# EAGLE design Inverter-demo (1) (EAGLE 9.6.2)
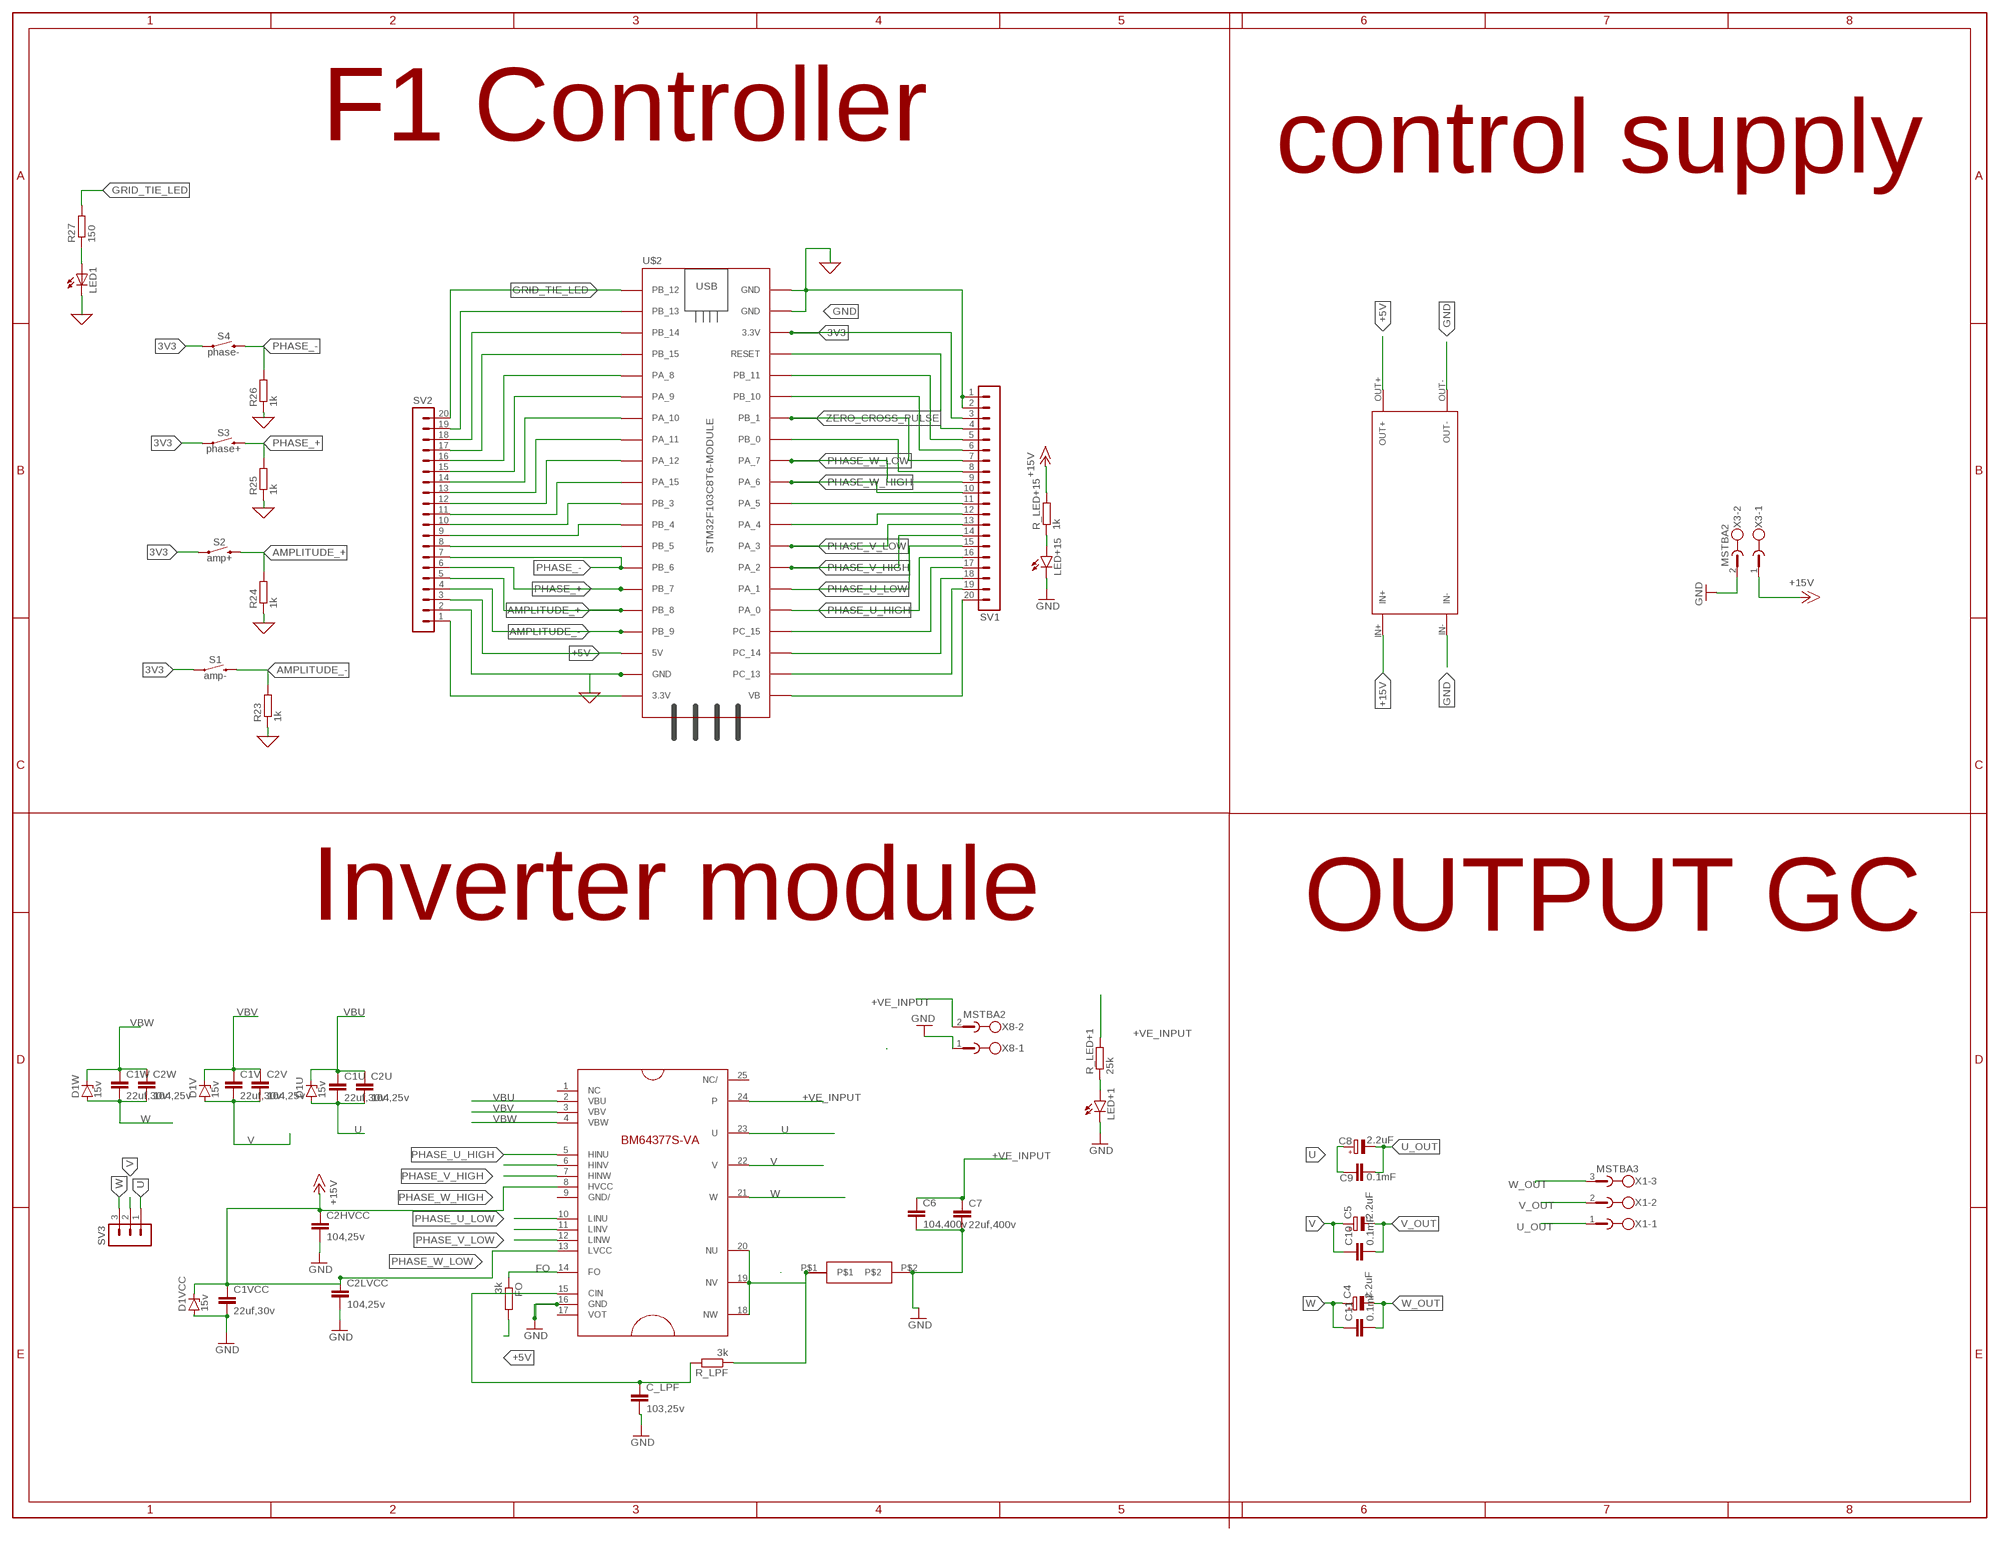
[diagram p0: schematic, sheet 1]

## Parts
C1U  22uf,30v  C-EU050-025X075  [C050-025X075]
C1V  22uf,30v  C-EU050-025X075  [C050-025X075]
C1VCC  22uf,30v  C-EU050-025X075  [C050-025X075]
C1W  22uf,30v  C-EU050-025X075  [C050-025X075]
C2HVCC  104,25v  C-EU050-025X075  [C050-025X075]
C2LVCC  104,25v  C-EU050-025X075  [C050-025X075]
C2U  104,25v  C-EU050-025X075  [C050-025X075]
C2V  104,25v  C-EU050-025X075  [C050-025X075]
C2W  104,25v  C-EU050-025X075  [C050-025X075]
C4  2.2uF  CPOL-EUE3.5-8  [E3,5-8]
C5  2.2uF  CPOL-EUE3.5-8  [E3,5-8]
C6  104,400v  C-EU050-025X075  [C050-025X075]
C7  22uf,400v  C-EU050-025X075  [C050-025X075]
C8  2.2uF  CPOL-EUE3.5-8  [E3,5-8]
C9  0.1mF  C5/5  [C5B5]
C10  0.1mF  C5/5  [C5B5]
C11  0.1mF  C5/5  [C5B5]
C_LPF  103,25v  C-EU050-025X075  [C050-025X075]
D1U  15v  ZENER-DIODEDO34-7  [DO34Z7]
D1V  15v  ZENER-DIODEDO34-7  [DO34Z7]
D1VCC  15v  ZENER-DIODEDO34-7  [DO34Z7]
D1W  15v  ZENER-DIODEDO34-7  [DO34Z7]
FO  3k  R-EU_0207/10  [0207/10]
LED1  LED3MM  [LED3MM]
LED+1  LED5MM  [LED5MM]
LED+15  LED5MM  [LED5MM]
R23  1k  R-EU_0207/10  [0207/10]
R24  1k  R-EU_0207/10  [0207/10]
R25  1k  R-EU_0207/10  [0207/10]
R26  1k  R-EU_0207/10  [0207/10]
R27  150  R-EU_0207/10  [0207/10]
R_LED+1  25k  R-EU_0207/10  [0207/10]
R_LED+15  1k  R-EU_0207/10  [0207/10]
R_LPF  3k  R-EU_0207/10  [0207/10]
S1  amp-  MOMENTARY-SWITCH-SPST-PTH-6.0MM  [TACTILE_SWITCH_PTH_6.0MM]
S2  amp+  MOMENTARY-SWITCH-SPST-PTH-6.0MM  [TACTILE_SWITCH_PTH_6.0MM]
S3  phase+  MOMENTARY-SWITCH-SPST-PTH-6.0MM  [TACTILE_SWITCH_PTH_6.0MM]
S4  phase-  MOMENTARY-SWITCH-SPST-PTH-6.0MM  [TACTILE_SWITCH_PTH_6.0MM]
SV1  MA20-1  [MA20-1]
SV2  MA20-1  [MA20-1]
SV3  MA03-1  [MA03-1]
U$1  BM64377S-VATHROUGH_HOLE  [IPM-BM64377S-VA]
U$2  STM32F103C8T6-MODULE  [STM32F103C8T6-MODULE]
U$3  SMALLSHUNT  [SMALLSHUNT]
U$4  XL4015_DC-DC_CONVERTER  [XL4015_DC-DC_CONVERTER]
X1  MSTBA3  [MSTBA3]
X3  MSTBA2  [MSTBA2]
X8  MSTBA2  [MSTBA2]

## Nets
3V3: S1.1 S2.1 S3.1 S4.1 SV1.3 U$2.3.3V_2(3.3V)
+5V: FO.2 SV2.3 U$2.5V U$4.OUT+
+15V: C1VCC.1 C2HVCC.1 C2LVCC.1 D1VCC.C R_LED+15.2 U$1.8(HVCC) U$1.13(LVCC) U$4.IN+ X3.1
+VE_INPUT: C6.1 C7.1 R_LED+1.2 U$1.24(P) X8.2
AMPLITUDE_+: R24.2 S2.3 SV2.5 U$2.PB_8
AMPLITUDE_-: R23.2 S1.3 SV2.4 U$2.PB_9
FO: FO.1 U$1.14(FO)
GND: C1VCC.2 C2HVCC.2 C2LVCC.2 C6.2 C7.2 C_LPF.2 D1VCC.A LED1.K(C) LED+1.K(C) LED+15.K(C) R23.1 R24.1 R25.1 R26.1 SV1.1 SV1.2 SV2.2 U$1.16(GND) U$2.GND_1(GND) U$2.GND_2(GND) U$2.GND_3(GND) U$3.P$2 U$4.IN- U$4.OUT- X3.2 X8.1
GRID_TIE_LED: R27.2 SV2.20 U$2.PB_12
N$1: LED+1.A R_LED+1.1
N$2: C_LPF.1 R_LPF.2 U$1.15(CIN)
N$5: R_LPF.1 U$1.18(NW) U$1.19(NV) U$1.20(NU) U$3.P$1
N$6: SV2.19 U$2.PB_13
N$7: SV2.18 U$2.PB_14
N$8: SV2.17 U$2.PB_15
N$9: SV2.16 U$2.PA_8
N$10: SV2.15 U$2.PA_9
N$11: SV2.14 U$2.PA_10
N$12: SV2.13 U$2.PA_11
N$13: SV2.12 U$2.PA_12
N$14: SV2.11 U$2.PA_15
N$15: SV2.10 U$2.PB_3
N$16: SV2.9 U$2.PB_4
N$17: LED1.A R27.1
N$18: SV2.8 U$2.PB_5
N$21: LED+15.A R_LED+15.1
N$22: SV2.1 U$2.3.3V_1(3.3V)
N$23: SV1.20 U$2.VB
N$24: SV1.19 U$2.PC_13
N$25: SV1.18 U$2.PC_14
N$26: SV1.17 U$2.PC_15
N$27: SV1.12 U$2.PA_4
N$28: SV1.11 U$2.PA_5
N$31: SV1.8 U$2.PB_0
N$33: SV1.6 U$2.PB_10
N$34: SV1.5 U$2.PB_11
N$35: SV1.4 U$2.RESET
PHASE_+: R25.2 S3.3 SV2.6 U$2.PB_7
PHASE_-: R26.2 S4.3 SV2.7 U$2.PB_6
PHASE_U_HIGH: SV1.16 U$1.5(HINU) U$2.PA_0
PHASE_U_LOW: SV1.15 U$1.10(LINU) U$2.PA_1
PHASE_V_HIGH: SV1.14 U$1.6(HINV) U$2.PA_2
PHASE_V_LOW: SV1.13 U$1.11(LINV) U$2.PA_3
PHASE_W_HIGH: SV1.10 U$1.7(HINW) U$2.PA_6
PHASE_W_LOW: SV1.9 U$1.12(LINW) U$2.PA_7
U: C1U.2 C2U.2 C8.+ C9.1 D1U.A SV3.1 U$1.23(U)
U_OUT: C8.- C9.2 X1.1
V: C1V.2 C2V.2 C5.+ C10.1 D1V.A SV3.2 U$1.22(V)
V_OUT: C5.- C10.2 X1.2
VBU: C1U.1 C2U.1 D1U.C U$1.2(VBU)
VBV: C1V.1 C2V.1 D1V.C U$1.3(VBV)
VBW: C1W.1 C2W.1 D1W.C U$1.4(VBW)
W: C1W.2 C2W.2 C4.+ C11.1 D1W.A SV3.3 U$1.21(W)
W_OUT: C4.- C11.2 X1.3
ZERO_CROSS_PULSE: SV1.7 U$2.PB_1
Unconnected: U$1.1(NC) U$1.9(GND/) U$1.17(VOT) U$1.25(NC/)

## Notes on the sheet
- control supply
- F1 Controller
- Inverter module | OUTPUT GC

## Library data of the parts
C1U C1V C1VCC C1W C2HVCC C2LVCC C2U C2V C2W C6 C7 C_LPF = rcl:C-EU: CAPACITOR, European symbol; SPICEPREFIX: C
C4 C5 C8 = resistor:CPOL-EU: POLARIZED CAPACITOR, European symbol
C9-C11 = capacitor-wima:C: CAPACITOR naming: grid - package width
D1U D1V D1VCC D1W = diode:ZENER-DIODE: Z-Diode
FO R23-R27 R_LED+1 R_LED+15 R_LPF = rcl:R-EU_: RESISTOR, European symbol; SPICEPREFIX: R
LED1 = adafruit:LED: LED
LED+1 LED+15 = led:LED: LED
S1-S4 = SparkFun-Switches:MOMENTARY-SWITCH-SPST: Momentary Switch (Pushbutton) - SPST Normally-open (NO) SPST momentary switches (buttons, pushbuttons). Variants PTH-12MM - 12mm square, through-hole Momentary Pushbutton Switch - 12mm Square <https://www.sparkfun.com/products/9190> (COM-09190) PTH-6.0MM, PTH-6.0MM-KIT - 6.0mm square, through-hole Mini Pushbutton Switch <https://www.sparkfun.com/products/97> (COM-00097) KIT package intended for soldering kit's - only one side of pads' copper is exposed. PTH-RIGHT-ANGLE-KIT - Right-angle, through-hole Right Angle Tactile Button <https://www.sparkfun.com/products/10791> - Used on SparkFun BigTime Watch Kit <https://www.sparkfun.com/products/11734> SMD-12MM - 12mm square, surface-mount Tactile Button - SMD (12mm) <https://www.sparkfun.com/products/12993> (COM-12993) Used on SparkFun PicoBoard <https://www.sparkfun.com/products/11888> SMD-4.5MM - 4.5mm Square Trackball Switch Used on SparkFun Blackberry Trackballer Breakout <https://www.sparkfun.com/products/13169> SMD-4.6MMX2.8MM - 4.60mm x 2.80mm, surface mount Used on SparkFun SAMD21 Mini Breakout <https://www.sparkfun.com/products/13664> SMD-5.2MM, SMD-5.2-REDUNDANT - 5.2mm square, surface-mount Mini Pushbutton Switch - SMD <https://www.sparkfun.com/products/8720> (COM-08720) Used on Arduino Pro Mini <https://www.sparkfun.com/products/11114> REDUNDANT package connects both switch circuits together SMD-6.0X3.5MM - 6.0 x 3.5mm, surface mount Momentary Reset Switch SMD <https://www.sparkfun.com/products/8229> (COM-08229) SMD-6.2MM-TALL - 6.2mm square, surface mount Tactile Button - SMD (6mm) <https://www.sparkfun.com/products/12992> Used on SparkFun Digital Sandbox <https://www.sparkfun.com/products/12651> SMD-RIGHT-ANGLE - Right-angle, surface mount Used on SparkFun Block for Intel® Edison - Arduino <https://www.sparkfun.com/products/13036>; PROD_ID: SWCH-08441; SF_SKU: COM-00097
SV1 SV2 = con-lstb:MA20-1: PIN HEADER; OC_FARNELL: unknown; OC_NEWARK: unknown
SV3 = con-lstb:MA03-1: PIN HEADER; OC_FARNELL: unknown; OC_NEWARK: unknown
U$1 = IPM_BM64377S-VA:BM64377S-VA
U$2 = stm32f103c8t6_module:STM32F103C8T6-MODULE: STM32F103C8T6 module with ARM Cortex-3, 20kB SRAM, 64kB Flash, 72MHz
U$3 = small shunt:SMALLSHUNT
U$4 = XL4015_DC-DC_CONVERTER:XL4015_DC-DC_CONVERTER
X1 = con-phoenix-508:MSTBA3: PHOENIX; MF: FARNELL; MPN: 1757255; OC_FARNELL: 3705183; OC_NEWARK: 71C4162
X3 X8 = con-phoenix-508:MSTBA2: PHOENIX; MF: FARNELL; MPN: 1757242; OC_FARNELL: 3705171; OC_NEWARK: 71C4161

## Board
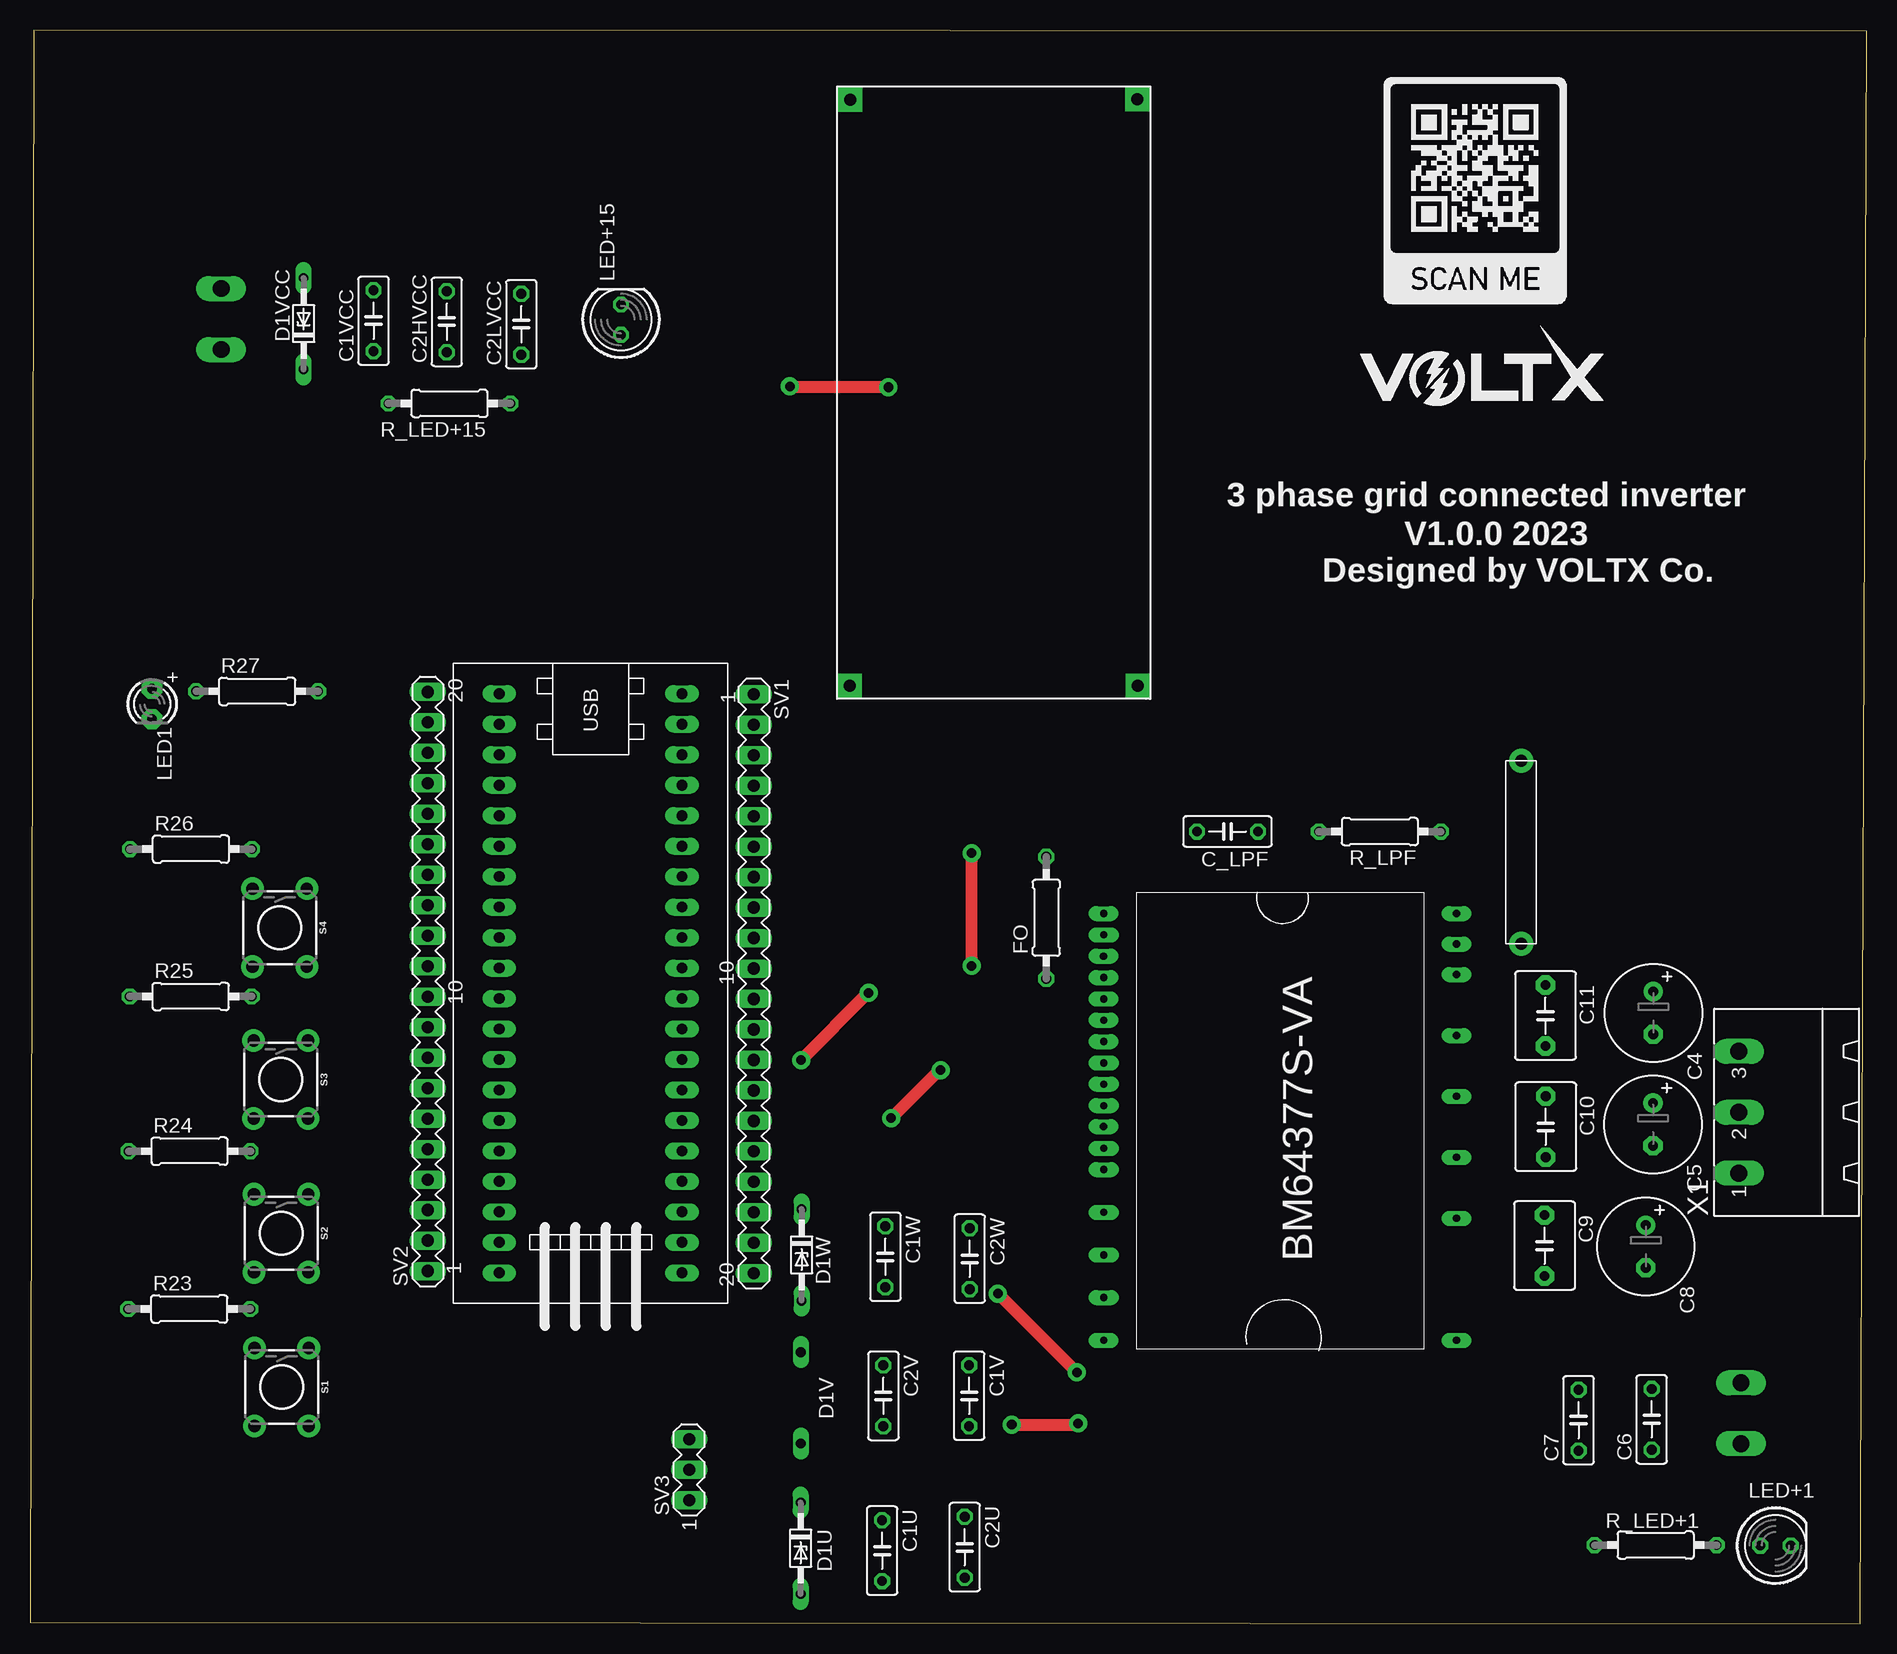
[diagram p1: board, top side]
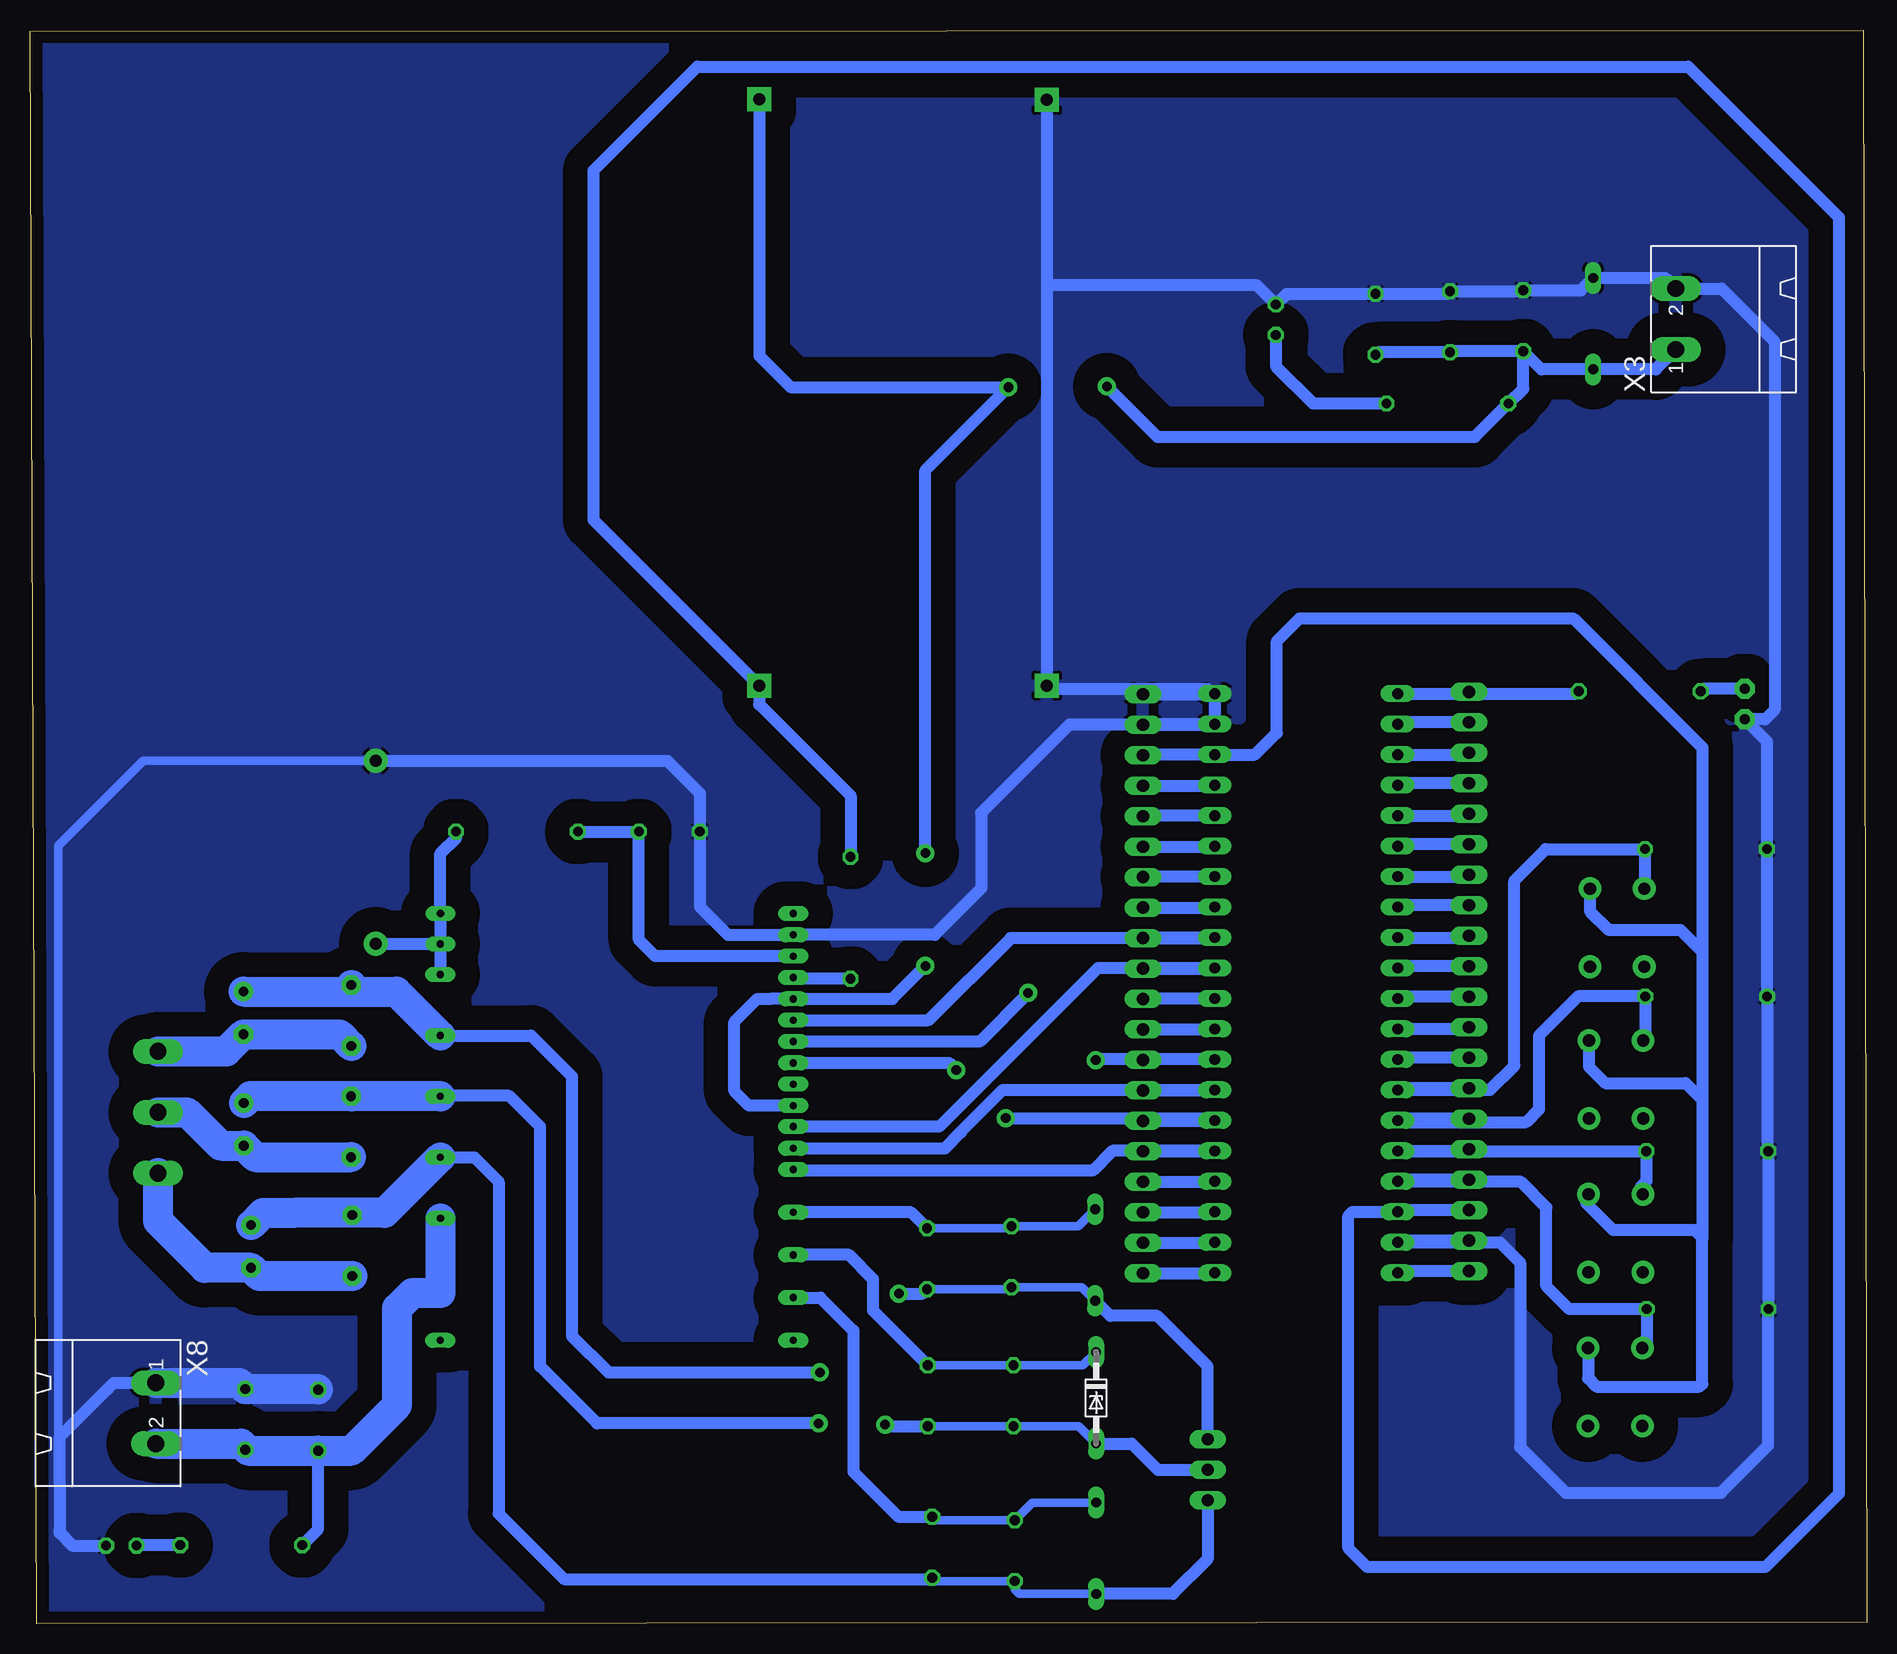
[diagram p2: board, bottom side, seen from below]

Size 153.07 x 132.81 mm. Coordinates in mm from the lower left corner, seen from the top.
Outline: 0.31,132.81 0,0.13 152.52,0 153.07,132.71 0.31,132.81
Copper layers (1*16): Top 0.035mm / dielectric 0.15mm / Bottom 0.035mm
Design rules "default *": minimum track width 6mil, minimum drill 0.35mm, track to track 80mil, track to pad 80mil, pad to pad 6mil, via to via 6mil, smd to smd 6mil, copper to edge 40mil, drill to drill 6mil, minimum pad ring 10mil, minimum via ring 8mil, stop-mask expansion 4mil, vias tented up to drill 0mil, thermal gap 10mil

### Footprints (pad centres in the part's own frame; a part is rotated, then mirrored left to right if it is on the bottom)
C050-025X075 = drill 0.813 octagon: 1 -2.54,0; 2 2.54,0
E3,5-8 = drill 0.813 pad 1.6: + -1.778,0 | drill 0.813 pad 1.6 octagon: - 1.778,0
C5B5 = drill 0.813 pad 1.6 octagon: 1 -2.54,0; 2 2.54,0
DO34Z7 = drill 0.813 long: A 3.81,0; C -3.81,0
0207/10 = drill 0.813 octagon: 1 -5.08,0; 2 5.08,0
LED3MM = drill 0.813 pad 1.676 octagon: A -1.27,0; K 1.27,0
LED5MM = drill 0.813 octagon: A -1.27,0; K 1.27,0
TACTILE_SWITCH_PTH_6.0MM = drill 1.016 pad 1.88: 1 -3.251,2.261; 2 3.251,2.261; 3 -3.251,-2.261; 4 3.251,-2.261
MA20-1 = drill 1.016 long: 1 -24.13,0; 2 -21.59,0; 3 -19.05,0; 4 -16.51,0; 5 -13.97,0; 6 -11.43,0; 7 -8.89,0; 8 -6.35,0; 9 -3.81,0; 10 -1.27,0; 11 1.27,0; 12 3.81,0; 13 6.35,0; 14 8.89,0; 15 11.43,0; 16 13.97,0; 17 16.51,0; 18 19.05,0; 19 21.59,0; 20 24.13,0
MA03-1 = drill 1.016 long: 1 -2.54,0; 2 0,0; 3 2.54,0
IPM-BM64377S-VA = drill 0.6 pad 1.27 long: 1 37.308,-2.702; 2 33.751,-2.696; 3 30.203,-2.697; 4 26.647,-2.696; 5 23.084,-2.7; 6 21.313,-2.695; 7 19.499,-2.713; 8 17.755,-2.701; 9 15.974,-2.701; 10 14.195,-2.701; 11 12.416,-2.701; 12 10.637,-2.703; 13 8.863,-2.702; 14 7.084,-2.702; 15 5.302,-2.705; 16 3.523,-2.696; 17 1.75,-2.701; 18 1.753,26.697; 19 4.291,26.701; 20 6.835,26.703; 21 11.913,26.705; 22 16.986,26.705; 23 22.066,26.705; 24 27.15,26.697; 25 37.312,26.704
STM32F103C8T6-MODULE = drill 0.9 long: 3.3V_1 25.4,-7.62; 3.3V_2 -17.78,7.62; 5V 20.32,-7.62; GND_1 22.86,-7.62; GND_2 -20.32,7.62; GND_3 -22.86,7.62; PA_0 15.24,7.62; PA_1 12.7,7.62; PA_2 10.16,7.62; PA_3 7.62,7.62; PA_4 5.08,7.62; PA_5 2.54,7.62; PA_6 0,7.62; PA_7 -2.54,7.62; PA_8 -12.7,-7.62; PA_9 -10.16,-7.62; PA_10 -7.62,-7.62; PA_11 -5.08,-7.62; PA_12 -2.54,-7.62; PA_15 0,-7.62; PB_0 -5.08,7.62; PB_1 -7.62,7.62; PB_3 2.54,-7.62; PB_4 5.08,-7.62; PB_5 7.62,-7.62; PB_6 10.16,-7.62; PB_7 12.7,-7.62; PB_8 15.24,-7.62; PB_9 17.78,-7.62; PB_10 -10.16,7.62; PB_11 -12.7,7.62; PB_12 -22.86,-7.62; PB_13 -20.32,-7.62; PB_14 -17.78,-7.62; PB_15 -15.24,-7.62; PC_13 22.86,7.62; PC_14 20.32,7.62; PC_15 17.78,7.62; RESET -15.24,7.62; VB 25.4,7.62
SMALLSHUNT = drill 1 pad 2: P$1 15.24,2.54; P$2 0,2.54
XL4015_DC-DC_CONVERTER = drill 1 pad 2 square: IN+ -23.88,12.74; IN- -23.84,-11.21; OUT+ 24.98,12.75; OUT- 24.97,-11.22
MSTBA3 = drill 1.397 long: 1 -5.08,5.08; 2 0,5.08; 3 5.08,5.08
MSTBA2 = drill 1.397 long: 1 -2.54,5.08; 2 2.54,5.08

### Placement (x,y rotation side)
C1U  71.01,6.09 270 top
C1V  78.26,19 270 top
C1VCC  28.63,108.58 90 top
C1W  71.28,30.58 270 top
C2HVCC  34.73,108.49 90 top
C2LVCC  40.94,108.29 90 top
C2U  77.89,6.38 270 top
C2V  71.11,18.99 270 top
C2W  78.31,30.42 270 top
C4  135.28,50.9 270 top
C5  135.25,41.61 270 top
C6  135.14,17.03 90 top
C7  129.05,16.96 90 top
C8  134.65,31.44 270 top
C9  126.21,31.51 270 top
C10  126.31,41.42 270 top
C11  126.29,50.68 270 top
C_LPF  99.79,66.01 180 top
D1U  64.22,6.29 270 top
D1V  64.23,18.82 270 bottom
D1VCC  22.8,108.34 90 top
D1W  64.3,30.73 270 top
FO  84.69,58.83 90 top
LED1  10.17,76.64 270 top
LED+1  145.46,6.51 0 top
LED+15  49.25,108.67 90 top
R23  13.27,26.23 0 top
R24  13.3,39.38 0 top
R25  13.39,52.27 0 top
R26  13.41,64.55 0 top
R27  18.93,77.7 0 top
R_LED+1  135.47,6.55 180 top
R_LED+15  34.95,101.69 180 top
R_LPF  112.49,66.01 180 top
S1  20.97,19.73 270 top
S2  20.93,32.54 270 top
S3  20.9,45.35 270 top
S4  20.81,58 270 top
SV1  60.32,53.33 270 top
SV2  33.15,53.52 90 top
SV3  54.93,12.83 90 top
U$1  92.17,60.93 270 top
U$2  46.72,54.64 270 top
U$3  121.72,71.91 270 top
U$4  79.55,103.15 270 top
U$8  [VOLTX_LOGO_0.8]  110.83,101.26 0 top
U$9  [SCAN2]  112.83,109.97 0 top
X1  147.48,42.62 90 top
X3  10.85,108.72 90 bottom
X8  147.66,17.54 270 bottom

### Tracks (layer width: path | path; a pad name or v marks a point on that pad's centre or on a via)
3V3
  Bottom 1: S1.1 23.23,20.45 22.53,19.75 13.95,19.75 13.71,19.99 13.71,32.15 | 13.71,32.15 14.36,32.8 21.15,32.8 23.38,35.03 23.38,35.6 S2.1 | S3.1 23.16,46.43 21.78,45.05 15.1,45.05 13.71,43.66 | 13.71,43.66 13.71,32.15 | S4.1 23.07,59.38 21.5,57.81 15.54,57.81 13.71,55.98 | 13.71,55.98 13.71,43.66 | 13.71,55.98 13.71,73.01 24.48,83.78 47.27,83.78 49.17,81.88 49.17,74.24 50.99,72.42 U$2.3.3V_2 60.28,72.42 SV1.3
+5V
  Bottom 1: FO.2 84.69,69.01 92.3,76.62 U$4.OUT+ 106.1,91.97 106.1,121.12 97.46,129.76 14.9,129.76 2.34,117.2 2.34,10.84 8.47,4.71 41.63,4.71 42.55,5.63 43.21,6.29 43.21,33.98 42.87,34.32 U$2.5V 38.95,34.47 SV2.3
+15V  (via drill 0.8 pad 1.5)
  Top 1: v71.54,103.04 63.4,103.04 v63.33,103.11 | v78.46,54.81 v78.46,64.21
  Bottom 1: X3.1 17.58,104.53 D1VCC.C 27.12,104.53 C1VCC.1 | C1VCC.1 34.64,106.04 C2HVCC.1 40.74,105.95 C2LVCC.1 | C1VCC.1 28.63,102.93 R_LED+15.2 32.66,98.9 59.12,98.9 v63.33,103.11 | U$4.IN+ 92.29,105.65 89.68,103.04 v71.54,103.04 78.46,96.12 v78.46,64.21 | v78.46,54.81 81.2,52.07 U$1.13 91.37,52.07 | U$1.8 93.16,43.17 94.37,44.38 94.37,50.16 92.46,52.07 91.37,52.07 | 91.37,52.07
+VE_INPUT
  Bottom 1: 135.05,14.4 C6.1 129.12,14.49 C7.1 129.05,7.89 R_LED+1.2
  Bottom 2.5: X8.2 135.47,15 134.89,14.42 C7.1 126.27,14.42 122.48,18.21 122.48,26.29 121.21,27.56 118.87,27.56 U$1.24
AMPLITUDE_+
  Bottom 1: S2.3 18.84,35.96 18.84,36.43 18.38,36.89 R24.2 39.08,39.38 U$2.PB_8 33.3,39.4 SV2.5
AMPLITUDE_-
  Bottom 1: S1.3 18.35,23.34 R23.2 18.51,26.23 18.53,26.21 24.79,26.21 26.71,28.12 26.71,34.66 28.9,36.86 U$2.PB_9 38.95,37.01 SV2.4
FO
  Bottom 1: FO.1 89.37,53.75 U$1.14
GND
  Bottom 0.7: U$3.P$2 143.62,71.91 150.7,64.83 150.7,15.46 146.63,19.53
  Bottom 1: LED+1.K 149.55,6.51 150.61,7.57 150.61,7.83 150.63,15.53 146.63,19.53 146.08,20.08 X8.1 | U$3.P$2 99.96,71.91 97.25,69.2 C_LPF.2 97.25,59.75 94.91,57.41 U$1.16 77.67,57.41 73.78,61.3 73.81,61.32 73.81,67.57 66.46,74.92 SV1.2 54.38,74.92 U$2.GND_2 | 8.22,26.26 R24.1 8.31,39.47 R25.1 8.33,52.29 R26.1 8.33,73.53 LED1.K 8.48,75.37 7.68,76.17 7.68,106.83 12.11,111.26 X3.2 16.82,112.15 D1VCC.A 23.83,111.12 C1VCC.2 28.72,111.03 C2HVCC.2 34.93,110.83 C2LVCC.2 48.36,110.83 LED+15.K 50.84,111.53 68.34,111.53 | 8.22,26.26 R23.1 | 8.22,26.26 8.22,14.86 12.17,10.91 25.09,10.91 28.89,14.71 28.89,30.09 30.58,31.78 U$2.GND_1 38.95,31.93 SV2.2 | U$2.GND_2 60.12,74.96 | U$4.IN- 68.34,111.53 | 68.34,111.53 U$4.OUT- 68.06,77.91 54.95,77.91 54.54,77.5 U$2.GND_3 | U$2.GND_3 U$2.GND_2 | SV1.1 54.38,77.46 U$2.GND_3
  Bottom 2.5: X8.1 135.65,20.08 C6.2 129.12,19.57 C7.2
  pour Bottom: 152.83,132.56 152.83,-0.08 0.43,-0.08 0.43,132.18 0.81,132.56
GRID_TIE_LED
  Bottom 1: R27.2 24.21,77.5 U$2.PB_12 33.3,77.5 SV2.20
N$1
  Bottom 1: R_LED+1.1 144.15,6.55 LED+1.A
N$2
  Bottom 1: R_LPF.2 C_LPF.1 102.33,56.98 100.98,55.63 91.74,55.63 U$1.15
N$5
  Bottom 1: U$1.19 U$1.18 118.87,64.19 117.57,65.49 R_LPF.1 | U$1.19 U$1.20 | U$3.P$1 118.91,56.67 U$1.19
N$6
  Bottom 1: SV2.19 39.54,75.11 39.61,75.04 39.53,74.96 U$2.PB_13
N$7
  Bottom 1: U$2.PB_14 32.87,72.42 32.57,72.72 33,72.72 SV2.18
N$8
  Bottom 1: SV2.17 38.95,70.03 U$2.PB_15
N$9
  Bottom 1: U$2.PA_8 33.3,67.34 SV2.16
N$10
  Bottom 1: SV2.15 38.95,64.95 U$2.PA_9
N$11
  Bottom 1: U$2.PA_10 33.3,62.26 SV2.14
N$12
  Bottom 1: SV2.13 38.95,59.87 U$2.PA_11
N$13
  Bottom 1: U$2.PA_12 33.3,57.18 SV2.12
N$14
  Bottom 1: SV2.11 38.95,54.79 U$2.PA_15
N$15
  Bottom 1: SV2.10 38.95,52.25 U$2.PB_3
N$16
  Bottom 1: U$2.PB_4 33.3,49.56 SV2.9
N$17
  Bottom 1: LED1.A 13.64,77.91 R27.1
N$18
  Bottom 1: SV2.8 38.95,47.17 U$2.PB_5
N$21
  Bottom 1: LED+15.A 49.25,104.79 46.15,101.69 R_LED+15.1
N$22
  Bottom 1: SV2.1 38.95,29.39 U$2.3.3V_1
N$23
  Bottom 1: SV1.20 54.38,29.2 U$2.VB
N$24
  Bottom 1: SV1.19 54.38,31.74 U$2.PC_13
N$25
  Bottom 1: SV1.18 54.38,34.28 U$2.PC_14
N$26
  Bottom 1: SV1.17 54.38,36.82 U$2.PC_15
N$27
  Bottom 1: SV1.12 54.38,49.52 U$2.PA_4
N$28
  Bottom 1: U$2.PA_5 60.28,52.1 SV1.11
N$31
  Bottom 1: SV1.8 54.38,59.68 U$2.PB_0
N$33
  Bottom 1: SV1.6 54.38,64.76 U$2.PB_10
N$34
  Bottom 1: U$2.PB_11 60.28,67.34 SV1.5
N$35
  Bottom 1: SV1.4 54.38,69.84 U$2.RESET
PHASE_+
  Bottom 1: S3.3 18.47,48.77 R25.2 24.05,52.27 27.34,48.98 27.34,42.87 28.4,41.81 38.46,41.81 | 38.46,41.81 38.97,41.81 U$2.PB_7 | SV2.6 38.18,42.09 38.46,41.81
PHASE_-
  Bottom 1: S4.3 18.49,61.31 R26.2 26.76,64.55 29.38,61.93 29.38,46.51 31.41,44.48 U$2.PB_6 38.95,44.63 SV2.7
PHASE_U_HIGH
  Bottom 1: U$1.5 89.38,37.76 64.52,37.76 62.88,39.4 U$2.PA_0 54.38,39.36 SV1.16
PHASE_U_LOW  (via drill 0.8 pad 1.5)
  Top 1: v75.88,46.14 75.76,46.14 v71.76,42.14
  Bottom 1: U$1.10 76.47,46.73 v75.88,46.14 | v71.76,42.14 54.54,42.14 U$2.PA_1 54.38,41.9 SV1.15
PHASE_V_HIGH
  Bottom 1: U$1.6 76.81,39.62 75.49,40.94 75.49,40.99 72,44.48 U$2.PA_2 54.32,44.5 53.81,44.5 53.87,44.44 SV1.14
PHASE_V_LOW  (via drill 0.8 pad 1.5)
  Top 1: v64.26,46.97 69.85,52.56 v69.89,52.56
  Bottom 1: v64.26,46.97 64.21,47.02 60.36,47.02 | v69.89,52.56 73.94,48.51 U$1.11 | U$2.PA_3 60.36,47.02 | SV1.13 60.36,47.02
PHASE_W_HIGH
  Bottom 1: U$1.7 77.3,41.43 64.09,54.64 U$2.PA_6 54.38,54.6 SV1.10
PHASE_W_LOW
  Bottom 1: U$1.12 78.21,50.29 71.36,57.14 60.11,57.14 60.07,57.18 U$2.PA_7 54.38,57.14 SV1.9
U
  Bottom 0.7: C2U.2 77.89,3.55 C1U.2 71.01,2.88 70.63,2.48 D1U.A
  Bottom 1: U$1.23 116.03,38.86 114.01,36.84 114.01,9.18 108.55,3.72 78.01,3.72 C2U.2 | C9.1 126.39,34.23 131.06,34.23 | SV3.1 54.93,5.38 57.83,2.48 D1U.A
  Bottom 2.5: U$1.23 123.51,34.23 131.06,34.23 133.64,34.23 C8.+
U_OUT
  Bottom 2.5: C9.2 133.96,28.97 C8.- 138.52,29.66 142.4,33.54 X1.1
V  (via drill 0.8 pad 1.5)
  Top 1: v81.81,16.59 87.25,16.59 v87.35,16.69
  Bottom 0.7: D1V.A 65.67,16.45 C2V.2 C1V.2
  Bottom 1: v81.81,16.59 81.68,16.46 C1V.2 | v87.35,16.69 105.81,16.69 110.57,21.45 110.57,41.42 113.14,43.99 118.92,43.99 | D1V.A 61.26,15.01 59.08,12.83 SV3.2
  Bottom 2.5: 118.92,43.99 U$1.22 126.29,43.94 C10.1 134.68,43.96 C5.+
V_OUT
  Bottom 2.5: X1.2 139.98,42.62 137.19,39.83 C5.- 134.3,38.88 C10.2
VBU
  Bottom 0.7: C2U.1 77.89,8.63 C1U.1 69.54,10.1 D1U.C
  Bottom 1: U$1.2 87.2,27.18 84.45,24.43 84.45,12.65 80.72,8.92 C2U.1
VBV
  Bottom 0.7: D1V.C 65.33,21.53 C2V.1 C1V.1
  Bottom 1: C1V.1 82.81,26.09 82.81,28.72 84.82,30.73 U$1.3
VBW
  Bottom 0.7: 78.41,33.06 C2W.1 71.44,32.96 C1W.1 65.72,33.12 D1W.C
  Bottom 1: C2W.1 79.63,34.28 U$1.4
W  (via drill 0.8 pad 1.5)
  Top 1: v87.24,20.94 v80.67,27.51 v80.66,27.51
  Bottom 0.7: D1W.A 65.42,28.04 C1W.2 71.44,27.88 C2W.2
  Bottom 1: U$1.21 111.31,49.02 107.91,45.62 107.91,23.99 104.86,20.94 v87.24,20.94 | v80.66,27.51 78.68,27.51 C2W.2 | SV3.3 54.93,21.44 59.14,25.65 63.03,25.65 D1W.A
  Bottom 2.5: C4.+ 125.75,52.68 | 125.75,52.68 122.53,52.68 U$1.21 | C11.1 125.75,52.68
W_OUT
  Bottom 2.5: X1.3 136.7,47.7 C4.- 127.27,49.12 C11.2
ZERO_CROSS_PULSE
  Bottom 1: U$2.PB_1 60.28,62.26 SV1.7

### Text on the board
tPlace: 3 phase grid connected inverter | V1.0.0 2023 | Designed by VOLTX Co.